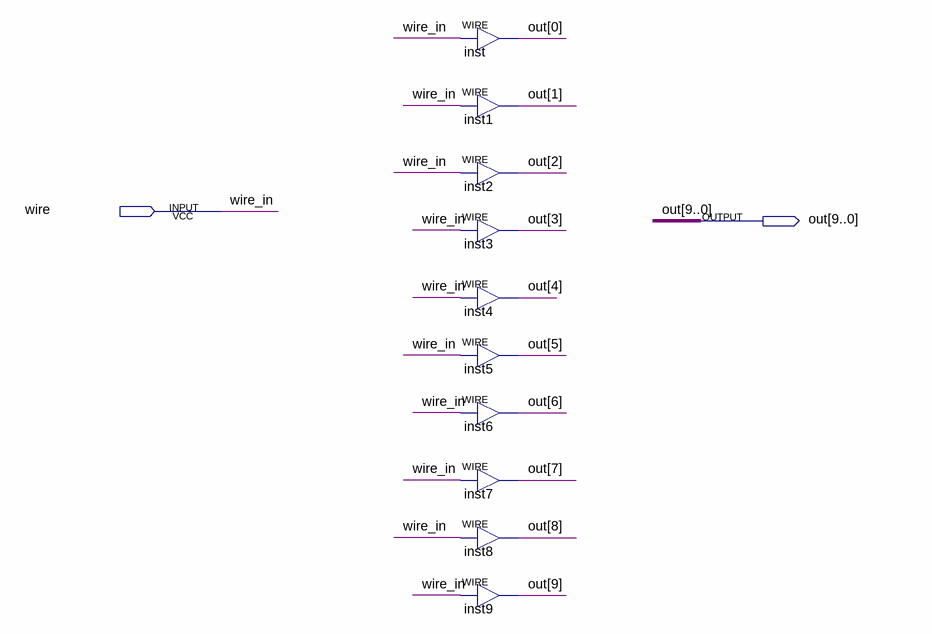
[diagram p0: schematic sheet]
// Quartus schematic to_bus.bdf as structural Verilog: 10 symbols, 2 pins
module to_bus (
  input  \wire ,
  output [9:0] out
);

  assign out[0] = \wire ;  // WIRE inst
  assign out[1] = \wire ;  // WIRE inst1
  assign out[2] = \wire ;  // WIRE inst2
  assign out[3] = \wire ;  // WIRE inst3
  assign out[4] = \wire ;  // WIRE inst4
  assign out[5] = \wire ;  // WIRE inst5
  assign out[6] = \wire ;  // WIRE inst6
  assign out[7] = \wire ;  // WIRE inst7
  assign out[8] = \wire ;  // WIRE inst8
  assign out[9] = \wire ;  // WIRE inst9

  // Other names for the same wires on the sheet: wire_in = \wire 
endmodule
